# EAGLE design satcam_v2 (EAGLE 5.11)
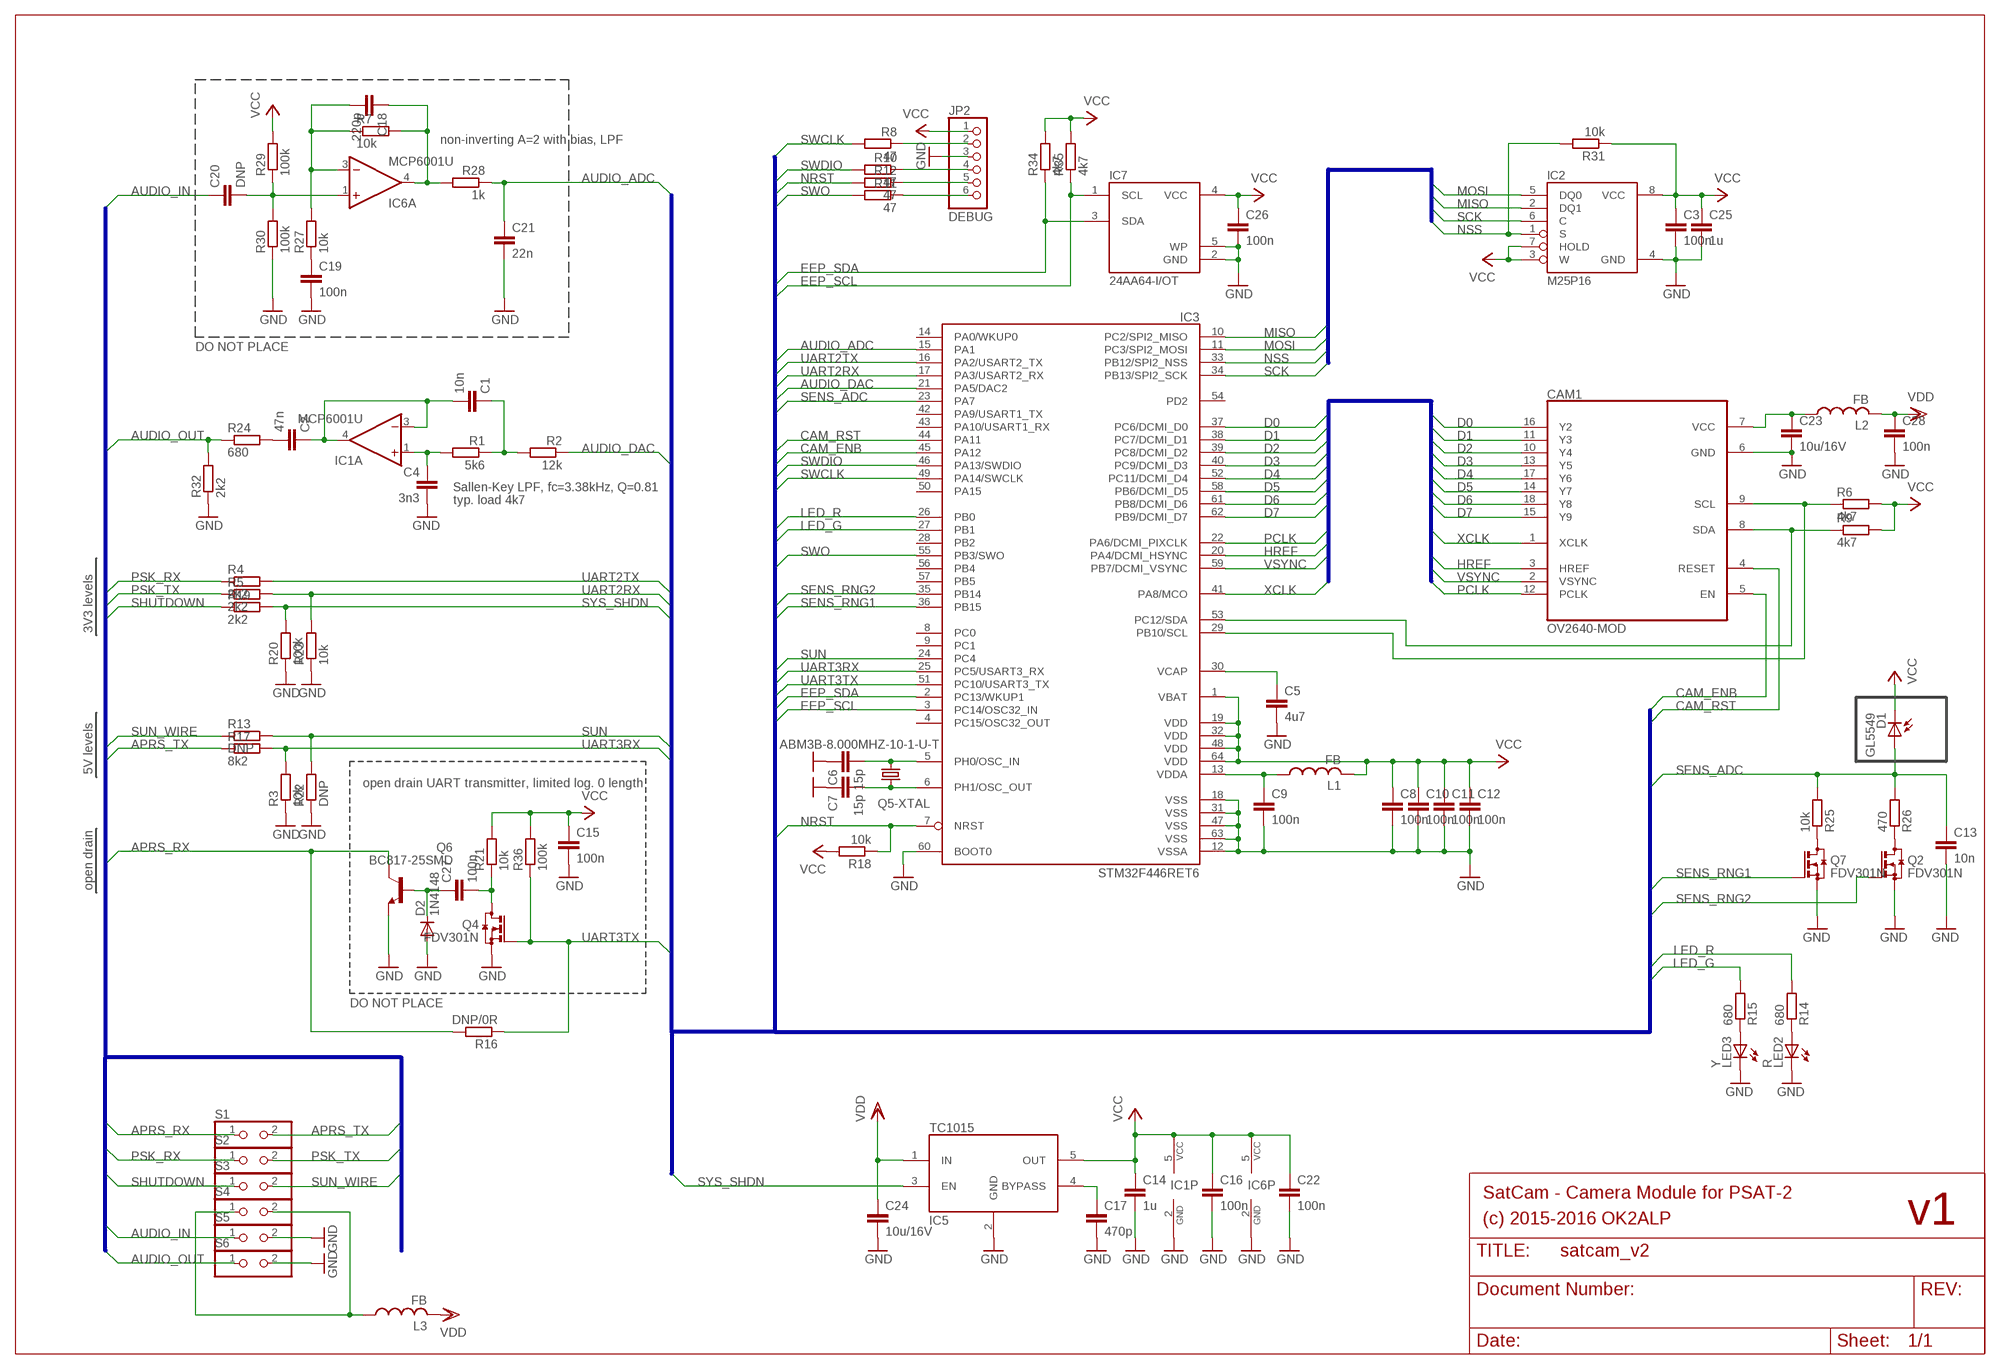
[diagram p0: schematic, sheet 1]

## Parts
C1  10n  C-EUC0603  [C0603]
C2  47n  C-EUC0603  [C0603]
C3  100n  C-EUC0603  [C0603]
C4  3n3  C-EUC0603  [C0603]
C5  4u7  C-EUC0603  [C0603]
C6  15p  C-EUC0603  [C0603]
C7  15p  C-EUC0603  [C0603]
C8  100n  C-EUC0603  [C0603]
C9  100n  C-EUC0603  [C0603]
C10  100n  C-EUC0603  [C0603]
C11  100n  C-EUC0603  [C0603]
C12  100n  C-EUC0603  [C0603]
C13  10n  C-EUC0603  [C0603]
C14  1u  C-EUC0603  [C0603]
C15  100n  C-EUC0603  [C0603]
C16  100n  C-EUC0603  [C0603]
C17  470p  C-EUC0603  [C0603]
C18  220p  C-EUC0603  [C0603]
C19  100n  C-EUC0603  [C0603]
C20  DNP  C-EUC0603  [C0603]
C21  22n  C-EUC0603  [C0603]
C22  100n  C-EUC0603  [C0603]
C23  10u/16V  C-EUC0805K  [C0805K]
C24  10u/16V  C-EUC0805K  [C0805K]
C25  1u  C-EUC0603  [C0603]
C26  100n  C-EUC0603  [C0603]
C27  100n  C-EUC0603  [C0603]
C28  100n  C-EUC0603  [C0603]
CAM1  OV2640-MOD  [OV2640-MOD]
D1  GL5549  SFH229-FLAT  [LED3MM-FLAT]
D2  1N4148  DIODE-MICROMELF-W  [MICROMELF-W]
IC1  MCP6001U  [SOT23-5]
IC2  M25P16  [SO08]
IC3  STM32F446RET6  [TQFP64-10X10]
IC5  TC1015  [SOT23-5]
IC6  MCP6001U  [SOT23-5]
IC7  24AA64-I/OT  [SOT23-5]
JP2  DEBUG  PINHD-1X6  [1X06]
L1  FB  [R0603]
L2  FB  [R0603]
L3  FB  [R0603]
LED2  R  LEDCHIP-LED0603  [CHIP-LED0603]
LED3  Y  LEDCHIP-LED0603  [CHIP-LED0603]
Q2  FDV301N  BSS123  [SOT23]
Q4  FDV301N  BSS123  [SOT23]
Q5  ABM3B-8.000MHZ-10-1-U-T  C3E_CRYSTAL-5032  [CER5032]
Q6  BC817-25SMD  [SOT23-BEC]
Q7  FDV301N  BSS123  [SOT23]
R1  5k6  R-EU_R0603  [R0603]
R2  12k  R-EU_R0603  [R0603]
R3  10k  R-EU_R0603  [R0603]
R4  2k2  R-EU_R0603  [R0603]
R5  2k2  R-EU_R0603  [R0603]
R6  4k7  R-EU_R0603  [R0603]
R7  10k  R-EU_R0603  [R0603]
R8  47  R-EU_R0603  [R0603]
R9  4k7  R-EU_R0603  [R0603]
R10  47  R-EU_R0603  [R0603]
R11  47  R-EU_R0603  [R0603]
R12  47  R-EU_R0603  [R0603]
R13  DNP  R-EU_R0603  [R0603]
R14  680  R-EU_R0603  [R0603]
R15  680  R-EU_R0603  [R0603]
R16  DNP/0R  R-EU_R0603  [R0603]
R17  8k2  R-EU_R0603  [R0603]
R18  10k  R-EU_R0603  [R0603]
R19  2k2  R-EU_R0603  [R0603]
R20  100k  R-EU_R0603  [R0603]
R21  10k  R-EU_R0603  [R0603]
R22  DNP  R-EU_R0603  [R0603]
R23  10k  R-EU_R0603  [R0603]
R24  680  R-EU_R0603  [R0603]
R25  10k  R-EU_R0603  [R0603]
R26  470  R-EU_R0603  [R0603]
R27  10k  R-EU_R0603  [R0603]
R28  1k  R-EU_R0603  [R0603]
R29  100k  R-EU_R0603  [R0603]
R30  100k  R-EU_R0603  [R0603]
R31  10k  R-EU_R0603  [R0603]
R32  2k2  R-EU_R0603  [R0603]
R34  4k7  R-EU_R0603  [R0603]
R35  4k7  R-EU_R0603  [R0603]
R36  100k  R-EU_R0603  [R0603]
S1  PINH21FINE_PITCH  [PINH2*1_FINE_PITCH]
S2  PINH21FINE_PITCH  [PINH2*1_FINE_PITCH]
S3  PINH21FINE_PITCH  [PINH2*1_FINE_PITCH]
S4  PINH21FINE_PITCH  [PINH2*1_FINE_PITCH]
S5  PINH21FINE_PITCH  [PINH2*1_FINE_PITCH]
S6  PINH21FINE_PITCH  [PINH2*1_FINE_PITCH]

## Nets
APRS_RX: Q6.C R16.2 S1.1
APRS_TX: R17.1 S1.2
AUDIO_ADC: C21.1 IC3.15(PA1) R28.1
AUDIO_DAC: IC3.21(PA5/DAC2) R2.1
AUDIO_IN: C20.1 S5.1
AUDIO_OUT: R24.1 R32.2 S6.1
CAM_ENB: CAM1.5(EN) IC3.45(PA12)
CAM_RST: CAM1.4(RESET) IC3.44(PA11)
CAM_SCL: CAM1.9(SCL) IC3.29(PB10/SCL) R6.1
CAM_SDA: CAM1.8(SDA) IC3.53(PC12/SDA) R9.1
D0: CAM1.16(Y2) IC3.37(PC6/DCMI_D0)
D1: CAM1.11(Y3) IC3.38(PC7/DCMI_D1)
D2: CAM1.10(Y4) IC3.39(PC8/DCMI_D2)
D3: CAM1.13(Y5) IC3.40(PC9/DCMI_D3)
D4: CAM1.17(Y6) IC3.52(PC11/DCMI_D4)
D5: CAM1.14(Y7) IC3.58(PB6/DCMI_D5)
D6: CAM1.18(Y8) IC3.61(PB8/DCMI_D6)
D7: CAM1.15(Y9) IC3.62(PB9/DCMI_D7)
EEP_SCL: IC3.3(PC14/OSC32_IN) IC7.1(SCL) R35.1
EEP_SDA: IC3.2(PC13/WKUP1) IC7.3(SDA) R34.1
GND: C3.2 C4.2 C5.2 C6.1 C7.1 C8.2 C9.2 C10.2 C11.2 C12.2 C13.2 C14.2 C15.2 C16.2 C17.2 C19.2 C21.2 C22.2 C23.2 C24.2 C25.2 C26.2 C28.2 CAM1.6(GND) D2.A IC1.2(P:GND) IC2.4(GND) IC3.12(VSSA) IC3.18(VSS) IC3.31(VSS) IC3.47(VSS) IC3.60(BOOT0) IC3.63(VSS) IC5.2(GND) IC6.2(P:GND) IC7.2(GND) IC7.5(WP) JP2.3 LED2.C LED3.C Q2.2(S) Q4.2(S) Q5.2(-GND1:GND) Q5.4(-GND2:GND) Q6.E Q7.2(S) R3.1 R20.1 R22.1 R23.1 R30.1 R32.1 S5.2 S6.2
HREF: CAM1.3(HREF) IC3.20(PA4/DCMI_HSYNC)
LED_G: IC3.27(PB1) R15.2
LED_R: IC3.26(PB0) R14.2
MISO: IC2.2(DQ1) IC3.10(PC2/SPI2_MISO)
MOSI: IC2.5(DQ0) IC3.11(PC3/SPI2_MOSI)
N$1: Q7.3(D) R25.1
N$2: Q2.3(D) R26.1
N$3: C19.1 R27.1
N$4: C18.1 IC6.4(A:OUT) R7.2 R28.2
N$6: C20.2 IC6.1(A:+IN) R29.1 R30.2
N$8: C18.2 IC6.3(A:-IN) R7.1 R27.2
N$9: C17.1 IC5.4(BYPASS)
N$10: LED3.A R15.1
N$11: LED2.A R14.1
N$12: C5.1 IC3.30(VCAP)
N$14: C27.1 D2.C Q6.B
N$17: C27.2 Q4.3(D) R21.1
N$18: C9.1 IC3.13(VDDA) L1.1
N$19: L3.1 S4.1 S4.2
N$20: C23.1 CAM1.7(VCC) L2.1
N$26: C7.2 IC3.6(PH1/OSC_OUT) Q5.3
N$27: C6.2 IC3.5(PH0/OSC_IN) Q5.1
N$129: C1.2 C2.1 IC1.3(A:-IN) IC1.4(A:OUT)
N$130: C1.1 R1.1 R2.2
N$131: C4.1 IC1.1(A:+IN) R1.2
N$137: JP2.4 R10.1
N$138: JP2.2 R8.1
N$143: JP2.5 R12.1
N$145: JP2.6 R11.1
N$152: C2.2 R24.2
NRST: IC3.7(NRST) R12.2 R18.1
NSS: IC2.1(S) IC3.33(PB12/SPI2_NSS) R31.2
PCLK: CAM1.12(PCLK) IC3.22(PA6/DCMI_PIXCLK)
PSK_RX: R4.1 S2.1
PSK_TX: R5.1 S2.2
SCK: IC2.6(C) IC3.34(PB13/SPI2_SCK)
SENS_ADC: C13.1 D1.A IC3.23(PA7) R25.2 R26.2
SENS_RNG1: IC3.36(PB15) Q7.1(G)
SENS_RNG2: IC3.35(PB14) Q2.1(G)
SHUTDOWN: R19.1 S3.1
SUN: IC3.24(PC4) R13.2 R22.2
SUN_WIRE: R13.1 S3.2
SWCLK: IC3.49(PA14/SWCLK) R8.2
SWDIO: IC3.46(PA13/SWDIO) R10.2
SWO: IC3.55(PB3/SWO) R11.2
SYS_SHDN: IC5.3(EN) R19.2 R20.2
UART2RX: IC3.17(PA3/USART2_RX) R5.2 R23.2
UART2TX: IC3.16(PA2/USART2_TX) R4.2
UART3RX: IC3.25(PC5/USART3_RX) R3.2 R17.2
UART3TX: IC3.51(PC10/USART3_TX) Q4.1(G) R16.1 R36.1
VCC: C3.1 C8.1 C10.1 C11.1 C12.1 C14.1 C15.1 C16.1 C22.1 C25.1 C26.1 D1.K(C) IC1.5(P:VCC) IC2.3(W) IC2.7(HOLD) IC2.8(VCC) IC3.1(VBAT) IC3.19(VDD) IC3.32(VDD) IC3.48(VDD) IC3.64(VDD) IC5.5(OUT) IC6.5(P:VCC) IC7.4(VCC) JP2.1 L1.2 R6.2 R9.2 R18.2 R21.2 R29.2 R31.1 R34.2 R35.2 R36.2
VDD: C24.1 C28.1 IC5.1(IN) L2.2 L3.2
VSYNC: CAM1.2(VSYNC) IC3.59(PB7/DCMI_VSYNC)
XCLK: CAM1.1(XCLK) IC3.41(PA8/MCO)
Unconnected: IC3.4(PC15/OSC32_OUT) IC3.8(PC0) IC3.9(PC1) IC3.14(PA0/WKUP0) IC3.28(PB2) IC3.42(PA9/USART1_TX) IC3.43(PA10/USART1_RX) IC3.50(PA15) IC3.54(PD2) IC3.56(PB4) IC3.57(PB5)

## Buses
D[0..7],PCLK,XCLK,HREF,VSYNC
AUDIO_DAC,AUDIO_ADC,UART2TX,UART2RX,SENS_ADC,SENS_RNG[1..2],CAM_RST,CAM_ENB,SUN,UART3TX,UART3RX,SWDIO,SWCLK,SWO,NRST,LED_R,LED_G,SYS_SHDN,EEP_SDA,EEP_SCL
MISO,MOSI,SCK,NSS
PSK_RX,PSK_TX,APRS_RX,APRS_TX,SUN_WIRE,SHUTDOWN,AUDIO_OUT,AUDIO_IN

## Notes on the sheet
- non-inverting A=2 with bias, LPF
- DO NOT PLACE
- Sallen-Key LPF, fc=3.38kHz, Q=0.81
- typ. load 4k7
- 3V3 levels
- 5V levels
- open drain UART transmitter, limited log. 0 length
- open drain
- DO NOT PLACE
- SatCam - Camera Module for PSAT-2
- (c) 2015-2016 OK2ALP | v1

## Library data of the parts
C1-C28 = rcl:C-EU: CAPACITOR, European symbol
CAM1 = satcam:OV2640-MOD: PIN HEADER
D1 = satcam:SFH229
D2 = diode:DIODE-: DIODE
IC1 IC6 = satcam:MCP6001U
IC2 = satcam:M25P16
IC3 = satcam:STM32F446RET6
IC5 = satcam:TC1015
IC7 = satcam:24AA64
JP2 = pinhead:PINHD-1X6: PIN HEADER
L1-L3 = satcam:FB
LED2 LED3 = led:LED: LED OSRAM: - CHIPLED LG R971, LG N971, LY N971, LG Q971, LY Q971, LO R971, LY R971 LH N974, LH R974 LS Q976, LO Q976, LY Q976 LO Q996 - Hyper CHIPLED LW Q18S LB Q993, LB Q99A, LB R99A - SideLED LS A670, LO A670, LY A670, LG A670, LP A670 LB A673, LV A673, LT A673, LW A673 LH A674 LY A675 LS A676, LA A676, LO A676, LY A676, LW A676 LS A679, LY A679, LG A679 - Hyper Micro SIDELED® LS Y876, LA Y876, LO Y876, LY Y876 LT Y87S - SmartLED LW L88C, LW L88S LB L89C, LB L89S, LG L890 LS L89K, LO L89K, LY L89K LS L896, LA L896, LO L896, LY L896 - TOPLED LS T670, LO T670, LY T670, LG T670, LP T670 LSG T670, LSP T670, LSY T670, LOP T670, LYG T670 LG T671, LOG T671, LSG T671 LB T673, LV T673, LT T673, LW T673 LH T674 LS T676, LA T676, LO T676, LY T676, LB T676, LH T676, LSB T676, LW T676 LB T67C, LV T67C, LT T67C, LS T67K, LO T67K, LY T67K, LW E67C LS E67B, LA E67B, LO E67B, LY E67B, LB E67C, LV E67C, LT E67C LW T67C LS T679, LY T679, LG T679 LS T770, LO T770, LY T770, LG T770, LP T770 LB T773, LV T773, LT T773, LW T773 LH T774 LS E675, LA E675, LY E675, LS T675 LS T776, LA T776, LO T776, LY T776, LB T776 LHGB T686 LT T68C, LB T68C - Hyper Mini TOPLED® LB M676 - Mini TOPLED Santana® LG M470 LS M47K, LO M47K, LY M47K Source: http://www.osram.convergy.de LUXEON: - LUMILED® LXK2-PW12-R00, LXK2-PW12-S00, LXK2-PW14-U00, LXK2-PW14-V00 LXK2-PM12-R00, LXK2-PM12-S00, LXK2-PM14-U00 LXK2-PE12-Q00, LXK2-PE12-R00, LXK2-PE12-S00, LXK2-PE14-T00, LXK2-PE14-U00 LXK2-PB12-K00, LXK2-PB12-L00, LXK2-PB12-M00, LXK2-PB14-N00, LXK2-PB14-P00, LXK2-PB14-Q00 LXK2-PR12-L00, LXK2-PR12-M00, LXK2-PR14-Q00, LXK2-PR14-R00 LXK2-PD12-Q00, LXK2-PD12-R00, LXK2-PD12-S00 LXK2-PH12-R00, LXK2-PH12-S00 LXK2-PL12-P00, LXK2-PL12-Q00, LXK2-PL12-R00 Source: www.luxeon.com KINGBRIGHT: KA-3528ASYC Source: www.kingbright.com
Q2 Q4 Q7 = transistor-small-signal:BSS123: N-CHANNEL MOS FET
Q5 = satcam:C3E_CRYSTAL
Q6 = transistor-npn:BC817*: NPN Transistor
R1-R32 R34-R36 = rcl:R-EU_: RESISTOR, European symbol
S1-S6 = satcam:PINH2*1

## Board
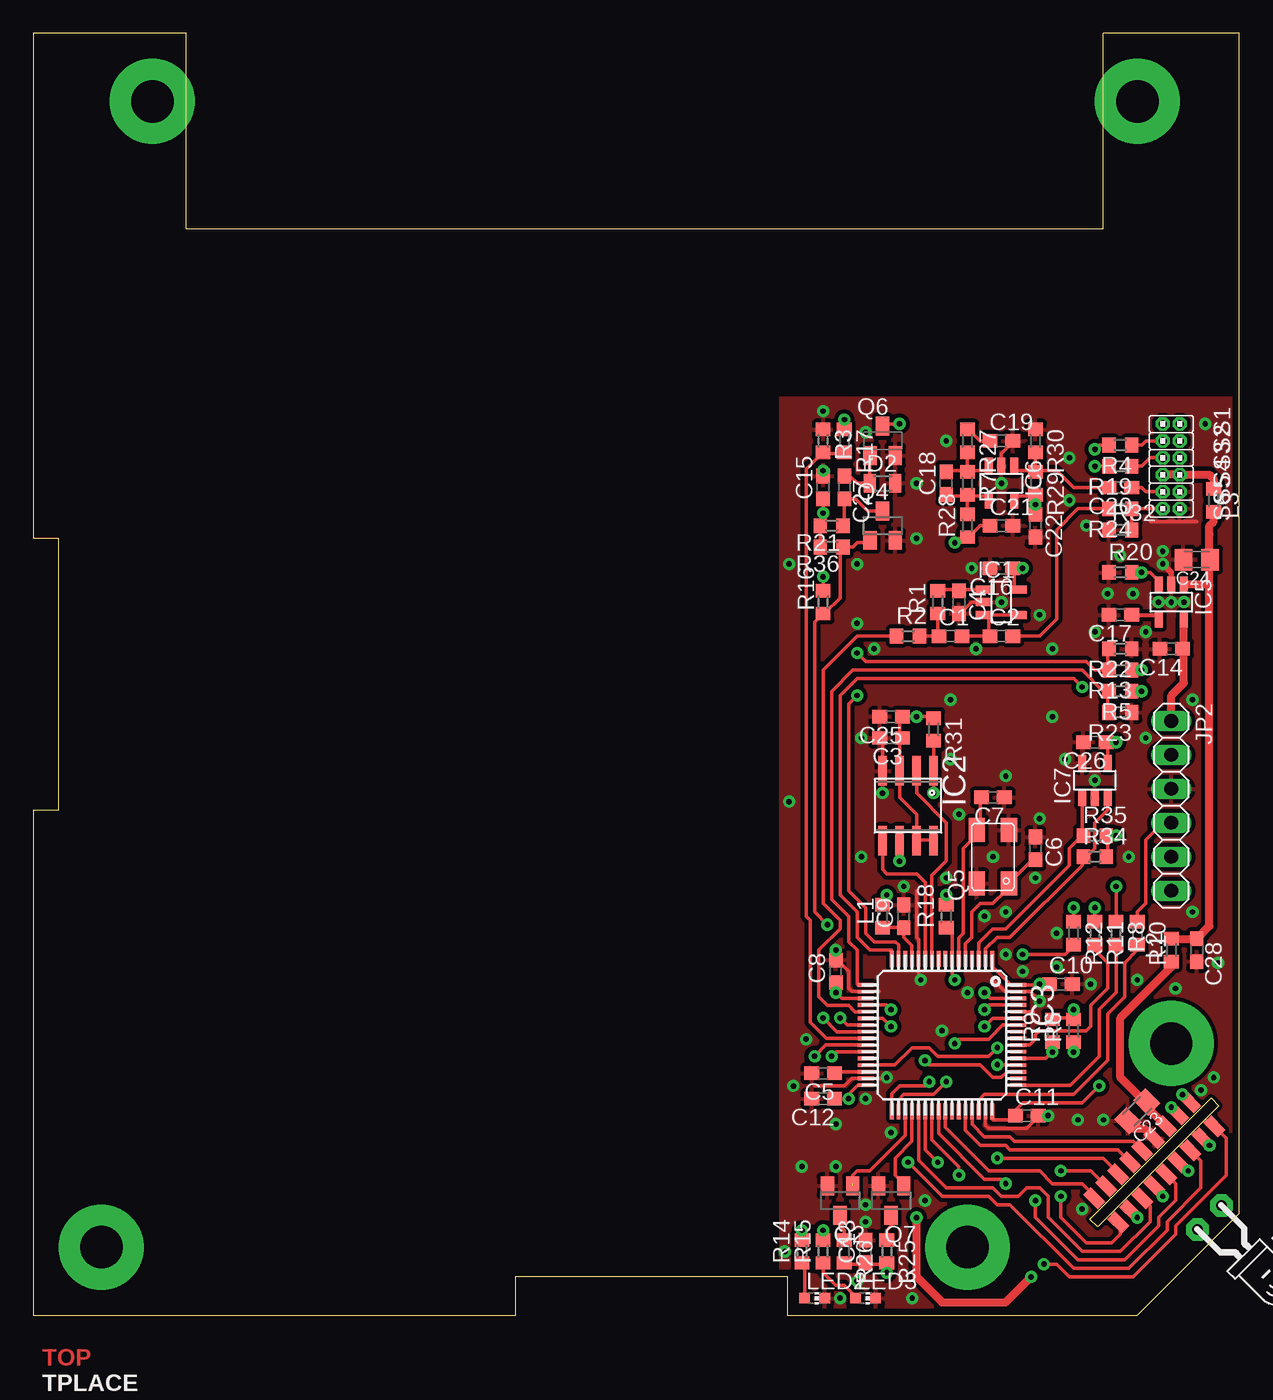
[diagram p1: board, top side]
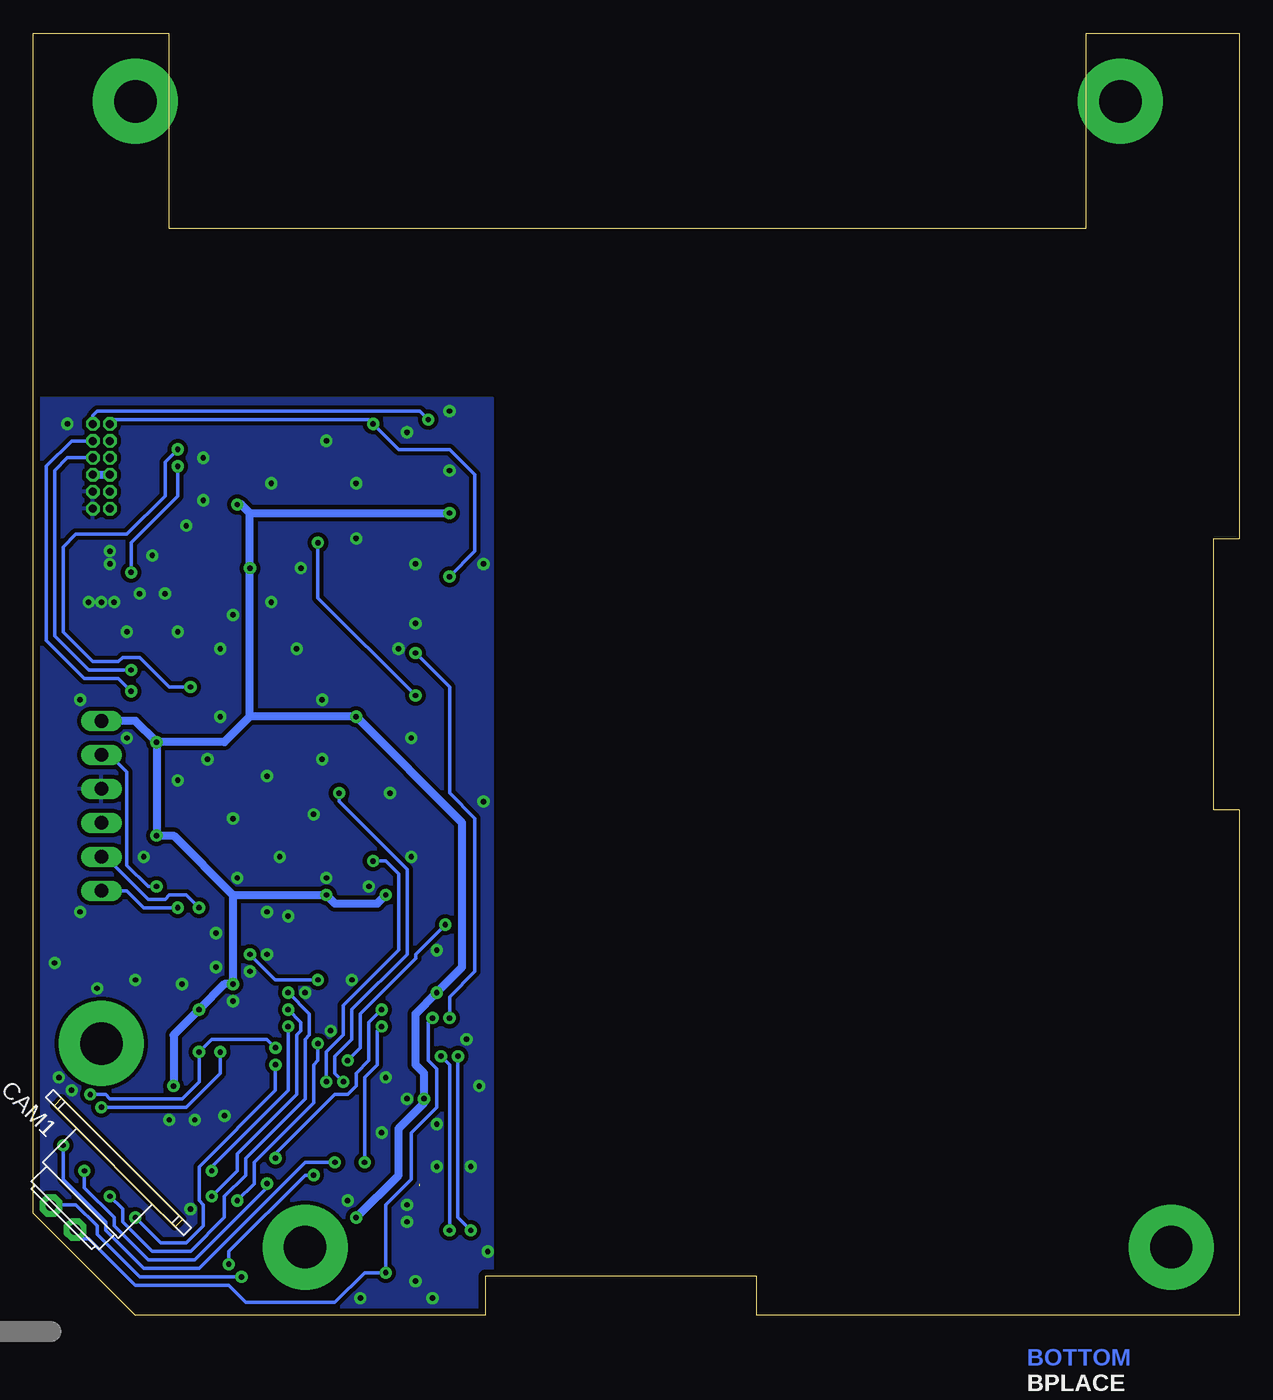
[diagram p2: board, bottom side, seen from below]

Size 90.17 x 95.89 mm. Coordinates in mm from the lower left corner, seen from the top.
Outline: 0,0 36.07,0 36.07,2.92 56.39,2.92 56.39,0 82.55,0 90.17,7.62 90.17,95.89 80.01,95.89 80.01,81.28 11.43,81.28 11.43,95.89 0,95.89 0,58.09 1.91,58.09 1.91,37.8 0,37.8 0,0
Copper layers (1*16): Top 0.035mm / dielectric 1.5mm / Bottom 0.035mm
Design rules "default *": minimum track width 10mil, minimum drill 0.4mm, track to track 8mil, track to pad 8mil, pad to pad 8mil, via to via 8mil, smd to smd 0mil, copper to edge 20mil, drill to drill 8mil, minimum pad ring 8mil, minimum via ring 10mil, stop-mask expansion 2mil, vias tented up to drill 0.4mm, thermal gap 12mil
bKeepout: area 69.8,0 to 90.2,20.3

### Footprints (pad centres in the part's own frame; a part is rotated, then mirrored left to right if it is on the bottom)
C0603 = smd 1.1 x 1: 1 -0.85,0; 2 0.85,0
C0805K = smd 1.3 x 1.6: 1 -1,0; 2 1,0
OV2640-MOD = smd 0.8 x 1.5 bottom: 1 -5.08,-1.27; 2 -3.81,-1.27; 3 -2.54,-1.27; 4 -1.27,-1.27; 5 0,-1.27; 6 1.27,-1.27; 7 2.54,-1.27; 8 3.81,-1.27; 9 5.08,-1.27; 10 5.08,1.27; 11 3.81,1.27; 12 2.54,1.27; 13 1.27,1.27; 14 0,1.27; 15 -1.27,1.27; 16 -2.54,1.27; 17 -3.81,1.27; 18 -5.08,1.27
LED3MM-FLAT = drill 0.8 pad 1.676 octagon: A -1.27,0; K 1.27,0
MICROMELF-W = smd 0.9 x 1.4: A 0.95,0; C -0.95,0
SOT23-5 = smd 0.6 x 1.2: 1 -0.95,-1.306; 2 0,-1.306; 3 0.95,-1.306; 4 0.95,1.306; 5 -0.95,1.306
SO08 = smd 0.61 x 2.21: 1 -1.905,-2.616; 2 -0.635,-2.616; 3 0.635,-2.616; 4 1.905,-2.616; 5 1.905,2.616; 6 0.635,2.616; 7 -0.635,2.616; 8 -1.905,2.616
TQFP64-10X10 = smd 1.2 x 0.28: 1 -5.7,3.75; 2 -5.7,3.25; 3 -5.7,2.75; 4 -5.7,2.25; 5 -5.7,1.75; 6 -5.7,1.25; 7 -5.7,0.75; 8 -5.7,0.25; 9 -5.7,-0.25; 10 -5.7,-0.75; 11 -5.7,-1.25; 12 -5.7,-1.75; 13 -5.7,-2.25; 14 -5.7,-2.75; 15 -5.7,-3.25; 16 -5.7,-3.75; 33 5.7,-3.75; 34 5.7,-3.25; 35 5.7,-2.75; 36 5.7,-2.25; 37 5.7,-1.75; 38 5.7,-1.25; 39 5.7,-0.75; 40 5.7,-0.25; 41 5.7,0.25; 42 5.7,0.75; 43 5.7,1.25; 44 5.7,1.75; 45 5.7,2.25; 46 5.7,2.75; 47 5.7,3.25; 48 5.7,3.75 | smd 0.28 x 1.2: 17 -3.75,-5.7; 18 -3.25,-5.7; 19 -2.75,-5.7; 20 -2.25,-5.7; 21 -1.75,-5.7; 22 -1.25,-5.7; 23 -0.75,-5.7; 24 -0.25,-5.7; 25 0.25,-5.7; 26 0.75,-5.7; 27 1.25,-5.7; 28 1.75,-5.7; 29 2.25,-5.7; 30 2.75,-5.7; 31 3.25,-5.7; 32 3.75,-5.7; 49 3.75,5.7; 50 3.25,5.7; 51 2.75,5.7; 52 2.25,5.7; 53 1.75,5.7; 54 1.25,5.7; 55 0.75,5.7; 56 0.25,5.7; 57 -0.25,5.7; 58 -0.75,5.7; 59 -1.25,5.7; 60 -1.75,5.7; 61 -2.25,5.7; 62 -2.75,5.7; 63 -3.25,5.7; 64 -3.75,5.7
1X06 = drill 1.016 long: 1 -6.35,0; 2 -3.81,0; 3 -1.27,0; 4 1.27,0; 5 3.81,0; 6 6.35,0
R0603 = smd 1 x 1.1: 1 -0.85,0; 2 0.85,0
CHIP-LED0603 = smd 0.8 x 0.8: A 0,-0.75; C 0,0.75
SOT23 = smd 1 x 1.4: 1 -0.95,-1.1; 2 0.95,-1.1; 3 0,1.1
CER5032 = smd 1.8 x 1.2: 1 -2,-1.2; 2 2,-1.2; 3 2,1.2; 4 -2,1.2
SOT23-BEC = smd 1 x 1.4: B -0.95,-1.1; C 0,1.1; E 0.95,-1.1
PINH2*1_FINE_PITCH = drill 0.6 pad 1.016 octagon: 1 0,-0.635; 2 0,0.635

### Placement (x,y rotation side)
C1  68.58,50.8 0 top
C2  72.39,50.8 0 top
C3  64.14,43.18 180 top
C4  69.22,53.34 270 top
C5  59.05,18.1 180 top
C6  74.93,34.92 270 top
C7  71.75,38.73 180 top
C8  60.01,25.72 90 top
C9  65.09,29.84 90 top
C10  76.83,24.77 0 top
C11  74.3,14.92 0 top
C12  59.05,16.19 180 top
C13  62.23,4.76 90 top
C14  85.09,49.85 180 top
C15  59.05,61.91 90 top
C16  72.39,55.88 180 top
C17  81.28,52.39 180 top
C18  68.26,62.23 90 top
C19  72.39,65.41 0 top
C20  81.28,61.91 180 top
C21  72.39,59.05 0 top
C22  74.93,59.05 270 top
C23  82.55,15.24 225 top
C24  87,56.52 180 top
C25  64.14,44.77 180 top
C26  79.38,42.86 180 top
C27  60.64,61.91 270 top
C28  87,27.3 270 top
CAM1  83.82,11.43 135 bottom
D1  87.95,7.3 45 top
D2  63.5,62.23 0 top
IC1  72.39,53.34 270 top
IC2  65.41,38.1 180 top
IC3  67.94,20.95 270 top
IC5  85.09,53.34 180 top
IC6  72.39,62.23 180 top
IC7  79.38,40.01 0 top
JP2  85.09,38.1 270 top
L1  63.5,29.84 90 top
L2  85.09,27.3 90 top
L3  88.27,60.96 270 top
LED2  58.42,1.27 270 top
LED3  62.23,1.27 270 top
Q2  60.33,8.57 180 top
Q4  63.5,59.05 0 top
Q5  71.75,34.29 90 top
Q6  63.5,65.41 0 top
Q7  64.14,8.57 180 top
R1  67.63,53.34 90 top
R2  65.41,50.8 0 top
R3  59.05,65.41 270 top
R4  81.28,65.09 180 top
R5  81.28,46.67 180 top
R6  77.79,21.27 90 top
R7  69.85,62.23 270 top
R8  80.96,28.57 270 top
R9  76.2,21.27 90 top
R10  82.55,28.57 270 top
R11  79.38,28.57 270 top
R12  77.79,28.57 270 top
R13  81.28,48.26 180 top
R14  57.47,4.76 90 top
R15  59.05,4.76 90 top
R16  59.05,53.34 90 top
R17  60.64,65.41 270 top
R18  68.26,29.84 90 top
R19  81.28,63.5 180 top
R20  81.28,55.56 0 top
R21  59.69,59.05 180 top
R22  81.28,49.85 180 top
R23  81.28,45.09 180 top
R24  81.28,60.33 180 top
R25  63.82,4.76 270 top
R26  60.64,4.76 270 top
R27  69.85,65.41 270 top
R28  69.85,59.05 90 top
R29  74.93,62.23 270 top
R30  74.93,65.41 270 top
R31  67.31,43.81 270 top
R32  81.28,58.74 0 top
R34  79.38,34.29 0 top
R35  79.38,35.88 0 top
R36  59.69,57.47 180 top
S1  85.09,66.67 270 top
S2  85.09,65.41 270 top
S3  85.09,64.14 270 top
S4  85.09,62.87 270 top
S5  85.09,61.59 270 top
S6  85.09,60.33 270 top

### Tracks (layer width: path | path; a pad name or v marks a point on that pad's centre or on a via)
APRS_RX  (via drill 0.4)
  Top 0.254: v64.77,66.67 63.67,66.67 Q6.C | R16.2 v59.05,55.24
  Bottom 0.254: S1.1 84.14,66.99 65.09,66.99 v64.77,66.67 62.87,64.77 59.05,64.77 57.15,62.87 57.15,57.15 v59.05,55.24
APRS_TX  (via drill 0.4)
  Top 0.254: R17.1 v60.64,66.99
  Bottom 0.254: S1.2 85.72,67.31 85.41,67.63 61.28,67.63 v60.64,66.99
AUDIO_ADC  (via drill 0.4)
  Top 0.254: C21.1 70.8,59.05 69.95,58.2 R28.1 69.85,58.1 69.22,58.1 v68.9,57.78 | IC3.15 64.69,27.7 64.45,27.94 62.87,27.94 62.23,28.57 62.23,30.48 60.96,31.75 60.96,45.72 v61.59,46.35
  Bottom 0.254: v68.9,57.78 68.9,53.66 v61.59,46.35
AUDIO_DAC
  Top 0.254: IC3.21 61.43,22.7 60.96,23.18 59.37,23.18 58.74,23.81 58.74,27.3 60.33,28.89 60.33,29.53 59.05,30.8 59.05,48.26 61.59,50.8 R2.1
AUDIO_IN
  Top 0.254: C20.1 82.87,61.91 83.19,61.59 S5.1
AUDIO_OUT
  Top 0.254: S6.1 R24.1 R32.2
CAM_ENB
  Top 0.254: CAM1.5 82.23,13.02 73.34,13.02 73.03,13.34 71.12,13.34 70.19,14.26 IC3.45
CAM_RST
  Top 0.254: IC3.44 69.69,13.81 70.8,12.7 72.71,12.7 73.03,12.38 81.07,12.38 CAM1.4
CAM_SCL  (via drill 0.4)
  Top 0.254: v85.92,16.51 CAM1.9 | IC3.29 64.42,18.7 65.72,20 66.99,20 67.63,19.37 71.44,19.37 v72.07,20 | v77.79,19.68 R6.1
  Bottom 0.254: v85.92,16.51 84.77,16.51 84.45,16.19 79.06,16.19 77.79,17.46 v77.79,19.68 76.83,20.64 72.71,20.64 v72.07,20
CAM_SDA  (via drill 0.4)
  Top 0.254: CAM1.8 85.09,15.55 v85.09,15.56 | R9.1 v76.2,19.68 75.72,19.2 IC3.53
  Bottom 0.254: v85.09,15.56 78.74,15.56 76.2,18.1 v76.2,19.68
D0
  Top 0.254: CAM1.16 83.5,8.15 83.5,6.99 81.28,4.76 78.42,4.76 75.88,7.3 75.88,8.89 75.25,9.53 74.3,9.53 73.66,8.89 72.39,8.89 71.75,9.53 68.26,9.53 66.19,11.59 IC3.37
D1  (via drill 0.4)
  Top 0.254: CAM1.11 87.94,12.7 v87.95,12.7 | IC3.38 66.69,12.36 v67.63,11.43
  Bottom 0.254: v87.95,12.7 87.95,10.16 84.77,6.99 84.77,6.35 81.92,3.49 77.79,3.49 69.85,11.43 v67.63,11.43
D2  (via drill 0.4)
  Top 0.254: CAM1.10 89.22,13.22 89.22,10.48 85.41,6.67 85.41,6.03 82.23,2.86 77.47,2.86 76.52,3.81 v75.56,3.81 | IC3.39 67.19,13.13 69.22,11.11 v69.22,10.48
  Bottom 0.254: v75.56,3.81 75.56,4.76 69.85,10.48 v69.22,10.48
D3  (via drill 0.4)
  Top 0.254: CAM1.13 86.25,10.79 v86.36,10.79 | IC3.40 67.69,13.59 71.12,10.16 72.39,10.16 v72.71,9.84
  Bottom 0.254: v86.36,10.79 86.36,9.53 84.14,7.3 84.14,6.67 81.6,4.13 78.11,4.13 72.71,9.53 v72.71,9.84
D4  (via drill 0.4)
  Top 0.254: CAM1.17 82.55,7.31 v82.55,7.3 | IC3.52 72.1,18.7 v72.07,18.73
  Bottom 0.254: v82.55,7.3 80.64,5.4 78.74,5.4 77.47,6.67 77.47,8.26 77.79,8.57 77.79,11.11 72.07,16.83 v72.07,18.73
D5  (via drill 0.4)
  Top 0.254: CAM1.14 85.41,9.84 85.41,8.57 84.14,7.3 84.14,6.67 81.6,4.13 78.11,4.13 74.93,7.3 v74.93,8.57 | IC3.58 72.5,21.7 71.44,20.64 69.22,20.64 v68.9,20.32
  Bottom 0.254: v68.9,20.32 68.9,19.05 69.22,18.73 69.22,15.88 73.66,11.43 73.66,9.84 v74.93,8.57
D6  (via drill 0.4)
  Top 0.254: CAM1.18 81.28,6.79 81.28,6.03 80.64,5.4 78.74,5.4 76.83,7.3 v76.83,8.89 | IC3.61 71.47,23.2 v71.12,22.86
  Bottom 0.254: v71.12,22.86 70.17,21.91 70.17,21.27 70.48,20.95 70.48,16.51 74.93,12.06 74.93,10.79 v76.83,8.89
D7  (via drill 0.4)
  Top 0.254: CAM1.15 84.45,9 v84.45,8.89 | IC3.62 71.55,23.7 v71.12,24.13
  Bottom 0.254: v84.45,8.89 83.5,7.94 83.5,6.99 81.28,4.76 78.42,4.76 75.88,7.3 75.88,8.89 74.3,10.48 74.3,11.75 69.85,16.19 69.85,20.64 69.53,20.95 69.53,22.54 v71.12,24.13
EEP_SCL
  Top 0.254: IC3.3 70.69,27.83 71.75,28.89 72.71,28.89 77.47,33.66 77.47,34.92 78.42,35.88 | IC7.1 78.42,38.73 78.42,35.88 | 78.42,35.88 R35.1
EEP_SDA
  Top 0.254: IC3.2 71.19,27.38 72.07,28.26 73.03,28.26 78.42,33.66 78.42,34.29 R34.1 78.74,34.29 79.38,34.92 79.38,36.83 80.33,37.78 80.33,38.73 IC7.3
GND  (via drill 0.4)
  Top 0.254: C4.2 69.22,52.39 70.17,53.34 IC1.2 | C19.2 73.34,65.41 72.39,64.45 IC6.2 | 58.42,17.14 60.64,17.14 61.2,17.7 IC3.31 63.42,17.7 | 74.93,23.81 74.54,24.2 IC3.63 72.63,24.2 71.75,25.08 | 66.19,25.55 IC3.12 66.19,28.1 66.04,28.26 66.04,31.75 | IC3.60 74.78,22.7 | IC3.47 71.19,14.21 71.44,13.97 74.3,13.97 75.25,14.92 C11.2 | 63.5,40.64 63.5,42.86 | C8.2 60.01,26.67 60.96,25.72 60.96,24.45 61.2,24.2 IC3.18 63.26,24.2 | 83.5,59.37 87,59.37
  Top 0.406: 85.09,54.61 85.09,55.56 v84.45,56.2
  Top 0.61: 81.77,14.61 C23.2 81.92,14.46 81.92,14.29 82.23,13.97 83.08,13.97 CAM1.6
  other vias: 80.01,14.61 75.88,14.92 75.25,23.5 85.09,53.34 84.14,53.34 86.04,53.34 60.01,27.3 60.01,14.29 64.14,13.65 63.82,17.78 57.78,20.64 65.09,32.07 61.91,43.18 68.58,41.59 76.52,28.57 73.98,25.72 79.06,24.77 78.11,14.61 88.27,17.78 87.31,16.83 85.41,24.45 82.55,25.08 74.93,32.7 77.15,41.59 68.26,32.7 76.2,44.77 76.2,49.85 62.87,49.85 61.59,51.75 75.25,52.39 83.19,51.12 84.45,57.15 87.63,66.67 77.47,64.14 77.47,60.96 72.39,62.23 72.39,53.34 70.17,55.88 70.48,49.85 68.58,46.04 86.68,46.04 72.71,26.99 79.38,40.01 69.85,24.13 67.94,21.27 63.5,39.05 75.25,37.15 66.36,25.08 71.12,29.84 76.52,26.04 66.67,8.57 81.28,56.83 82.23,53.98 80.33,53.98 79.38,51.12 81.92,34.29 83.19,43.18 71.75,34.29 78.42,7.94 62.23,16.19 88.58,26.35 86.68,30.16 61.91,34.29 59.05,63.18 56.52,38.42 59.05,67.63 56.52,56.2 66.04,62.23 66.04,58.1 61.59,56.2 68.26,65.41 62.23,66.04 72.71,40.32 69.22,37.47 72.71,30.16 62.23,6.99 62.23,8.26 60.01,11.11 61.59,2.54 60.33,1.27 65.72,1.27 56.2,4.76 57.47,11.11 56.83,17.14 78.74,59.05
  pour Top (isolate 0.305): 55.88,0 90.17,0 90.17,68.58 55.88,68.58
  pour Bottom (isolate 0.305): 55.88,0 90.17,0 90.17,68.58 55.88,68.58
HREF  (via drill 0.4)
  Top 0.254: CAM1.3 80.64,11.01 80.64,11.11 80.01,11.75 v72.07,11.75 | IC3.20 63.79,23.2 v64.14,22.86
  Bottom 0.254: v64.14,22.86 65.09,21.91 65.09,19.05 66.04,18.1 66.04,17.14 66.67,16.51 67.63,16.51 72.07,12.06 v72.07,11.75
LED_G  (via drill 0.4)
  Top 0.254: IC3.27 60.03,19.7 v59.69,19.37 | R15.2 v59.05,6.35
  Bottom 0.254: v59.69,19.37 59.05,18.73 v59.05,6.35
LED_R  (via drill 0.4)
  Top 0.254: IC3.26 59.26,20.2 v58.42,19.37 | R14.2 v57.47,6.35
  Bottom 0.254: v58.42,19.37 58.42,7.3 v57.47,6.35
MISO
  Top 0.254: IC2.2 66.04,39.05 68.26,36.83 68.26,33.97 67.19,32.91 IC3.10
MOSI
  Top 0.254: IC3.11 66.69,32.37 66.04,33.02 63.82,33.02 63.5,33.34 IC2.5 63.5,35.56
N$1
  Top 0.254: R25.1 63.82,6.35 64.14,6.67 Q7.3
N$2
  Top 0.254: R26.1 60.64,6.35 60.33,6.67 Q2.3
N$3
  Top 0.254: R27.1 69.85,66.36 70.8,65.41 C19.1
N$4
  Top 0.254: R28.2 69.85,61.28 | C18.1 68.26,61.28 69.85,61.28 | IC6.4 71.44,61.27 71.44,61.28 69.85,61.28 | 69.85,61.28 R7.2
N$5  (via drill 3.17 pad 6.35)
  other vias: 5.08,5.08
N$6
  Top 0.254: IC6.1 73.34,63.19 73.34,63.18 74.93,63.18 | 74.93,63.18 R30.2 | C20.2 77.79,61.91 76.52,63.18 74.93,63.18 | 74.93,63.18 R29.1
N$7  (via drill 3.17 pad 6.35)
  other vias: 8.89,90.81
N$8
  Top 0.254: 69.85,63.18 R27.2 | C18.2 68.26,63.18 69.85,63.18 | IC6.3 71.44,63.19 71.44,63.18 69.85,63.18 | 69.85,63.18 R7.1
N$9
  Top 0.305: IC5.4 84.14,52.39 C17.1
N$10
  Top 0.254: LED3.A 61.48,1.39 60.64,2.22 60.01,2.22 59.05,3.17 R15.1
N$11
  Top 0.254: LED2.A 57.67,3.71 R14.1
N$12
  Top 0.254: C5.1 60.01,18.1 60.12,18.2 IC3.30
N$13  (via drill 3.17 pad 6.35)
  other vias: 82.55,90.81
N$14
  Top 0.254: Q6.B D2.C 61.59,62.23 61.06,62.76 C27.1
N$17
  Top 0.254: R21.1 60.64,59.16 C27.2 61.49,61.06 62.4,60.16 Q4.3
N$18
  Top 0.254: IC3.13 65.69,27.65 65.09,28.26 C9.1 L1.1
N$19
  Top 0.61: S4.1 S4.2 87.95,62.87 88.27,62.55 L3.1
  Bottom 0.61: S4.2 S4.1
N$20
  Top 0.406: C23.1 83.19,15.88
  Top 0.61: CAM1.7 83.19,15.66 83.19,15.88 81.28,17.78 81.28,22.23 85.09,26.04 L2.1
N$26
  Top 0.254: IC3.6 69.19,28.24 69.53,28.57 69.53,34.92 70.17,35.56 70.17,35.9 Q5.3 70.8,36.54 70.8,38.73 C7.2
N$27
  Top 0.254: IC3.5 69.69,27.79 70.17,28.26 70.17,30.16 70.8,30.8 71.75,30.8 72.71,31.75 72.71,32.04 Q5.1 74.74,34.08 C6.2
N$120  (via drill 3.17 pad 6.35)
  other vias: 69.85,5.08
N$121  (via drill 3.17 pad 6.35)
  other vias: 85.09,20.32
N$129
  Top 0.254: C1.2 71.44,50.8 | 71.44,50.8 C2.1 | 71.44,50.8 71.44,52.39 | 71.44,52.39 IC1.3 | IC1.4 71.44,52.39
N$130
  Top 0.254: R2.2 C1.1 67.63,50.8 R1.1
N$131
  Top 0.254: IC1.1 69.22,54.29 | R1.2 67.63,54.29 69.22,54.29 | 69.22,54.29 C4.1
N$137
  Top 0.254: JP2.4 84.45,36.83 83.19,35.56 83.19,30.8 82.55,30.16 R10.1
N$138  (via drill 0.4)
  Top 0.254: R8.1 v80.96,32.07
  Bottom 0.254: JP2.2 84.45,41.91 83.19,40.64 83.19,33.66 81.6,32.07 v80.96,32.07
N$143  (via drill 0.4)
  Top 0.254: R12.1 v77.79,30.48
  Bottom 0.254: v77.79,30.48 78.74,31.43 80.01,31.43 80.33,31.11 81.6,31.11 84.77,34.29 JP2.5
N$145  (via drill 0.4)
  Top 0.254: R11.1 v79.38,30.48
  Bottom 0.254: v79.38,30.48 81.92,30.48 83.19,31.75 JP2.6
N$152
  Top 0.254: C2.2 75.25,50.8 76.52,52.07 76.52,58.74 78.11,60.33 R24.2
NRST  (via drill 0.4)
  Top 0.254: R18.1 68.26,28.89 68.69,28.46 IC3.7 68.69,25.29 v68.9,25.08 | R12.2 77.79,27.62 77.15,26.99 v73.98,26.99
  Bottom 0.254: v68.9,25.08 72.07,25.08 v73.98,26.99
NSS  (via drill 0.4)
  Top 0.254: IC3.33 64.19,16.57 64.77,17.14 66.67,17.14 v66.99,17.46 | v67.31,39.05 IC2.1 R31.2 67.31,43.18
  Bottom 0.254: v66.99,17.46 67.63,18.1 67.63,19.37 66.36,20.64 66.36,22.86 62.23,26.99 62.23,33.34 67.31,38.42 v67.31,39.05
PCLK  (via drill 0.4)
  Top 0.254: IC3.22 63.52,22.2 v64.14,21.59 | CAM1.12 87.31,11.53 87.31,9.53 84.77,6.99 84.77,6.35 81.92,3.49 77.79,3.49 73.03,8.26 72.07,8.26 71.44,8.89 67.94,8.89 v65.41,11.43
  Bottom 0.254: v64.14,21.59 64.45,21.27 64.45,18.73 65.41,17.78 v65.41,11.43
PSK_RX
  Top 0.254: R4.1 82.87,65.09 83.19,65.41 S2.1
PSK_TX  (via drill 0.4)
  Top 0.254: R5.1 v82.87,46.67
  Bottom 0.254: v82.87,46.67 83.82,47.62 86.36,47.62 89.22,50.48 89.22,63.5 87.31,65.41 S2.2
SCK  (via drill 0.4)
  Top 0.254: IC3.34 64.69,16.12 65.09,16.51 67.31,16.51 v68.26,17.46 | 64.77,35.56 IC2.6 v64.77,33.97
  Bottom 0.254: v68.26,17.46 68.26,19.68 66.99,20.95 66.99,23.18 62.87,27.3 62.87,32.7 62.87,33.02 63.82,33.97 v64.77,33.97
SENS_ADC  (via drill 0.4)
  Top 0.254: 60.64,4.13 R26.2 60.64,3.81 62.23,3.81 | R25.2 63.82,3.81 62.23,3.81 | IC3.23 60.84,21.7 v60.33,22.23 | 62.23,3.81 C13.1 | R25.2 63.92,3.81 | R25.2 v63.82,3.17
  Bottom 0.254: D1.A 86.36,5.71 86.04,5.71 82.55,2.22 75.56,2.22 74.3,0.95 67.63,0.95 65.41,3.17 v63.82,3.17 63.82,8.26 61.91,10.16 61.91,13.65 60.01,15.56 60.01,18.41 60.64,19.05 60.64,21.91 v60.33,22.23
SENS_RNG1
  Top 0.254: Q7.1 65.08,9.84 65.09,9.84 64.45,10.48 64.45,11.75 65.69,12.99 IC3.36
SENS_RNG2  (1 unrouted)
  Top 0.254: IC3.35 65.19,13.44 62.55,10.79 61.59,10.79 61.28,10.48 Q2.1 | 61.27,9.84 61.28,9.84
SHUTDOWN
  Top 0.254: R19.1 82.87,63.5 83.5,64.14 S3.1
SUN  (via drill 0.4)
  Top 0.254: IC3.24 60.08,21.2 v59.05,22.23 | v61.59,49.53 62.23,48.9 78.74,48.9 79.38,48.26 80.33,48.26 | R22.2 80.33,49.85 80.33,48.26 | 80.33,48.26 R13.2
  Bottom 0.254: v61.59,49.53 59.05,46.99 59.05,39.05 57.15,37.15 57.15,25.72 59.05,23.81 v59.05,22.23
SUN_WIRE  (via drill 0.4)
  Top 0.254: R13.1 v82.87,48.26
  Bottom 0.254: v82.87,48.26 86.04,48.26 88.58,50.8 88.58,63.18 87.63,64.14 S3.2
SWCLK
  Top 0.254: IC3.49 77.53,17.2 79.69,19.37 79.69,22.86 80.96,24.13 R8.2
SWDIO
  Top 0.254: IC3.46 70.69,16.09 71.12,16.51 77.79,16.51 80.33,19.05 80.33,22.54 81.6,23.81 81.6,26.35 82.55,27.3 R10.2
SWO
  Top 0.254: 79.38,27.62 R11.2 79.38,27.3 80.33,26.35 80.33,24.45 79.06,23.18 79.06,21.59 78.74,21.27 75.25,21.27 74.93,20.95 74.93,20.64 74.5,20.2 IC3.55
SYS_SHDN  (via drill 0.4)
  Top 0.254: 80.64,63.5 R19.2 v79.38,63.5 | IC5.3 84.14,54.92 83.5,55.56 v82.87,55.56 R20.2
  Bottom 0.254: v79.38,63.5 79.38,61.28 82.87,57.78 v82.87,55.56
UART2RX
  Top 0.254: IC3.17 61.66,24.7 61.59,24.77 61.59,27.3 60.96,27.94 60.96,29.84 59.69,31.11 59.69,46.67 61.28,48.26 78.42,48.26 80.01,46.67 80.33,46.67 | R23.2 80.33,45.09 80.33,46.67 | 80.33,46.67 R5.2
UART2TX  (via drill 0.4)
  Top 0.254: IC3.16 64.19,27.25 64.14,27.3 62.55,27.3 61.59,28.26 61.59,30.16 60.33,31.43 60.33,46.35 61.59,47.62 77.79,47.62 v78.42,46.99 | v79.38,64.77 79.69,65.09 R4.2
  Bottom 0.254: v78.42,46.99 80.01,46.99 82.23,49.21 83.5,49.21 83.82,48.9 85.72,48.9 87.95,51.12 87.95,57.47 87,58.42 83.19,58.42 80.33,61.28 80.33,63.82 v79.38,64.77
UART3RX
  Top 0.254: IC3.25 59.3,20.7 58.1,21.91 58.1,29.53 57.78,29.84 57.78,63.28 R3.2 59.05,64.45 60.64,64.45 R17.2
UART3TX  (via drill 0.4)
  Top 0.254: IC3.51 72.81,18.2 72.39,17.78 71.75,17.78 70.8,18.73 66.99,18.73 v66.67,19.05 | Q4.1 62.38,57.78 61.59,57.78 61.28,57.47 R36.1 60.33,57.25 60.33,53.66 59.16,52.49 R16.1 58.42,51.85 58.42,30.16 v59.37,29.21
  Bottom 0.254: v66.67,19.05 65.72,20 65.72,22.54 61.59,26.67 61.59,26.99 v59.37,29.21
VCC  (via drill 0.4)
  Top 0.254: IC1.5 73.34,54.29 73.34,55.88 | 73.34,55.88 C16.1 | IC6.5 73.34,61.27 73.34,61.28 74.93,61.28 R29.2 v74.93,60.64 C22.1 | v73.98,55.88 73.34,55.88 | C12.1 v60.96,16.19 60.96,16.51 61.66,17.2 IC3.32 | IC3.1 71.69,26.09 73.08,24.7 IC3.64 75.19,24.7 v75.25,24.77 C10.1 | R9.2 76.2,22.23 77.79,22.23 | IC3.48 71.69,14.66 71.75,14.61 73.34,14.61 73.44,14.71 C11.1 73.44,15.34 73.98,15.88 78.42,15.88 v79.69,17.14 | 77.79,22.23 R6.2 | v77.79,22.86 77.79,22.23 | v68.26,31.43 R18.2 | 66.04,35.56 IC2.7 | 66.04,35.56 66.04,37.47 64.77,38.73 IC2.3 64.77,43.18 | 66.04,35.56 67.31,35.56 IC2.8 | 64.77,43.18 C3.1 | IC3.19 60.43,23.7 v60.01,24.13 C8.1 | 64.77,43.18 64.77,44.77 C25.1 v66.04,44.77 67.31,44.77 R31.1 | R34.2 80.33,34.29 80.33,35.88 R35.2 v80.96,35.88 | IC7.4 80.33,41.28 80.33,41.27 80.33,42.86 | 80.33,42.86 C26.1 | v80.96,42.86 80.33,42.86 | L1.2 63.5,31.11 v63.82,31.43 | R36.2 R21.2 59.05,59.27 v59.05,60.01 C15.1 58.95,60.96
  Top 0.61: v74.61,2.86 72.71,0.95 67.94,0.95 66.04,2.86 v66.04,7.3 | C14.1 86.04,49.85 | 86.04,49.85 IC5.5 | 86.04,49.85 86.04,47.3 85.09,46.35 JP2.1
  Bottom 0.254: D1.K 88.79,8.26 87,8.26 85.41,6.67 85.41,6.03 82.23,2.86 v74.61,2.86 | 60.96,15.88 v60.96,16.19
  Bottom 0.61: v60.96,16.19 60.96,18.1 61.59,18.73 61.59,22.54 v60.01,24.13 58.1,26.04 58.1,36.83 v66.04,44.77 73.98,44.77 | 60.96,15.88 62.87,13.97 62.87,10.48 v66.04,7.3 | v79.69,17.14 79.69,20.95 v77.79,22.86 75.88,24.77 v75.25,24.77 75.25,31.43 | 73.98,44.77 75.88,42.86 v80.96,42.86 | 73.98,44.77 v73.98,55.88 73.98,60.01 | 73.98,60.01 74.61,60.64 v74.93,60.64 | v63.82,31.43 64.45,30.8 67.63,30.8 v68.26,31.43 75.25,31.43 | JP2.1 82.55,44.45 v80.96,42.86 | 73.98,60.01 v59.05,60.01 | v80.96,42.86 v80.96,35.88 79.69,35.88 75.25,31.43
VDD
  Top 0.61: 87.95,56.52 87.95,58.42 87.95,59.05 88.27,59.37 L3.2 | 87.95,56.52 C24.1 | 87.95,54.61 87.95,56.52 | IC5.1 87.91,54.65 87.95,54.61 | L2.2 C28.1 87.95,29.11 87.95,54.61
VSYNC  (via drill 0.4)
  Top 0.254: CAM1.2 79.07,10.79 v76.83,10.79 | IC3.59 71.73,22.2 v71.12,21.59
  Bottom 0.254: v76.83,10.79 76.83,11.11 71.12,16.83 v71.12,21.59
XCLK
  Top 0.254: IC3.41 68.19,14.04 71.44,10.79 75.25,10.79 76.2,9.84 78.42,9.84 79.33,8.94 CAM1.1

### Text on the board
Top: TOP
Bottom: BOTTOM
tPlace: TPLACE
bPlace: BPLACE
tValues: DNP | DNP | DNP
Measures: 0.6" | spaceframe | cut 2x0.35" | 0.6" | FOV 60°
Document: camera clearance | height min. 15mm
silk: SatCam board | APRS_RX | PSK_RX | APRS_TX | SHUTDOWN | PSK_TX | SUN_WIRE | +5V | DREL | AUDIO_IN | +5V | AUDIO_OUT | GND | GND | v2/ | 2016 | SatCam | PSAT-2 | VCC | OK2ALP | SW- | CLK | GND | SW- | DIO | RST | SWO